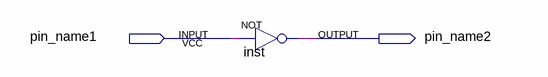
[diagram p0: schematic sheet]
// Quartus schematic not_gate.bdf as structural Verilog: 1 symbols, 2 pins
module not_gate (
  input  pin_name1,
  output pin_name2
);

  not inst (pin_name2, pin_name1);
endmodule
